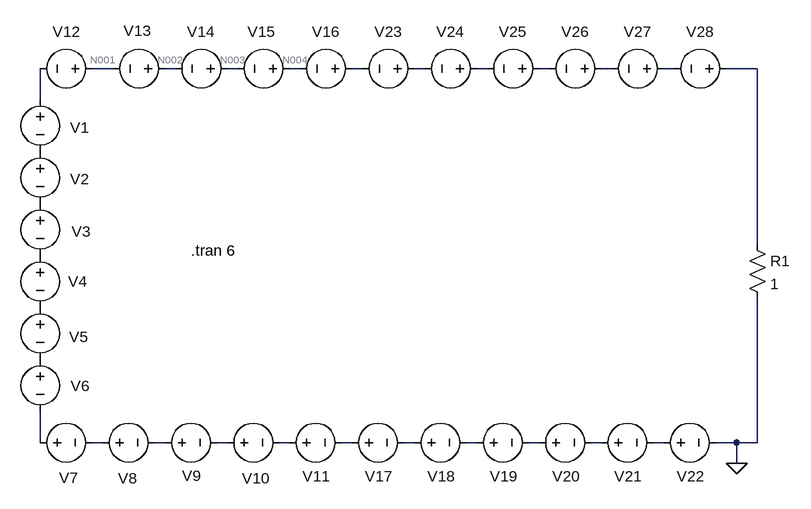
[diagram p0: schematic Cos.asc]
Cos.asc, the LTspice schematic file:
Version 4
SHEET 1 1740 680
WIRE -512 -16 -544 -16
WIRE -416 -16 -432 -16
WIRE -320 -16 -336 -16
WIRE -224 -16 -240 -16
WIRE -128 -16 -144 -16
WIRE -32 -16 -48 -16
WIRE 64 -16 48 -16
WIRE 160 -16 144 -16
WIRE 256 -16 240 -16
WIRE 352 -16 336 -16
WIRE 480 -16 432 -16
WIRE -624 32 -624 -16
WIRE 480 256 480 -16
WIRE -624 560 -624 512
WIRE -528 560 -544 560
WIRE -432 560 -448 560
WIRE -336 560 -352 560
WIRE -240 560 -256 560
WIRE -144 560 -160 560
WIRE -48 560 -64 560
WIRE 48 560 32 560
WIRE 144 560 128 560
WIRE 240 560 224 560
WIRE 336 560 320 560
WIRE 448 560 416 560
WIRE 480 560 480 336
WIRE 480 560 448 560
WIRE 448 592 448 560
FLAG 448 592 0
SYMBOL voltage -624 16 R0
WINDOW 123 0 0 Left 0
WINDOW 39 0 0 Left 0
WINDOW 0 46 59 Left 2
WINDOW 3 24 96 Invisible 2
SYMATTR InstName V1
SYMATTR Value SINE(0.31830989 0.21220659 1 0 0 90)
SYMBOL voltage -624 96 R0
WINDOW 123 0 0 Left 0
WINDOW 39 0 0 Left 0
WINDOW 0 46 58 Left 2
WINDOW 3 24 96 Invisible 2
SYMATTR InstName V2
SYMATTR Value SINE(0 -0.0424413 2 0 0 90)
SYMBOL voltage -624 176 R0
WINDOW 123 0 0 Left 0
WINDOW 39 0 0 Left 0
WINDOW 0 48 59 Left 2
WINDOW 3 24 96 Invisible 2
SYMATTR InstName V3
SYMATTR Value SINE(0 0.01818914 3 0 0 90)
SYMBOL res 464 240 R0
SYMATTR InstName R1
SYMATTR Value 1
SYMBOL voltage -624 256 R0
WINDOW 123 0 0 Left 0
WINDOW 39 0 0 Left 0
WINDOW 0 72 56 Right 2
WINDOW 3 -65 -119 Invisible 2
SYMATTR InstName V4
SYMATTR Value SINE(0 -0.0101051 4 0 0 90)
SYMBOL voltage -624 336 R0
WINDOW 123 0 0 Left 0
WINDOW 39 0 0 Left 0
WINDOW 0 74 61 Right 2
WINDOW 3 -65 -119 Invisible 2
SYMATTR InstName V5
SYMATTR Value SINE(0 0.0064305 5 0 0 90)
SYMBOL voltage -624 416 R0
WINDOW 123 0 0 Left 0
WINDOW 39 0 0 Left 0
WINDOW 0 76 57 Right 2
WINDOW 3 -65 -119 Invisible 2
SYMATTR InstName V6
SYMATTR Value SINE(0 -0.0044519 6 0 0 90)
SYMBOL voltage -640 560 R270
WINDOW 123 0 0 Left 0
WINDOW 39 0 0 Left 0
WINDOW 0 -54 45 VRight 2
WINDOW 3 -65 -119 Invisible 2
SYMATTR InstName V7
SYMATTR Value SINE(0 0.00326472 7 0 0 90)
SYMBOL voltage -544 560 R270
WINDOW 123 0 0 Left 0
WINDOW 39 0 0 Left 0
WINDOW 0 -55 40 VRight 2
WINDOW 3 -65 -119 Invisible 2
SYMATTR InstName V8
SYMATTR Value SINE(0 -0.0024965 8 0 0 90)
SYMBOL voltage -448 560 R270
WINDOW 123 0 0 Left 0
WINDOW 39 0 0 Left 0
WINDOW 0 -51 42 VRight 2
WINDOW 3 -65 -119 Invisible 2
SYMATTR InstName V9
SYMATTR Value SINE(0 0.42441318 1)
SYMBOL voltage -352 560 R270
WINDOW 123 0 0 Left 0
WINDOW 39 0 0 Left 0
WINDOW 0 -55 39 VRight 2
WINDOW 3 -65 -119 Invisible 2
SYMATTR InstName V10
SYMATTR Value SINE(0 0.16976527 2)
SYMBOL voltage -256 560 R270
WINDOW 123 0 0 Left 0
WINDOW 39 0 0 Left 0
WINDOW 0 -52 36 VRight 2
WINDOW 3 -65 -119 Invisible 2
SYMATTR InstName V11
SYMATTR Value SINE(0 0.10913482 3)
SYMBOL voltage -528 -16 R90
WINDOW 123 0 0 Left 0
WINDOW 39 0 0 Left 0
WINDOW 0 -57 34 VRight 2
WINDOW 3 -65 -119 Invisible 2
SYMATTR InstName V12
SYMATTR Value SINE(0 0.08084061 4)
SYMBOL voltage -416 -16 R90
WINDOW 123 0 0 Left 0
WINDOW 39 0 0 Left 0
WINDOW 0 -58 37 VRight 2
WINDOW 3 -65 -119 Invisible 2
SYMATTR InstName V13
SYMATTR Value SINE(0 0.06430503 5)
SYMBOL voltage -320 -16 R90
WINDOW 123 0 0 Left 0
WINDOW 39 0 0 Left 0
WINDOW 0 -57 35 VRight 2
WINDOW 3 -65 -119 Invisible 2
SYMATTR InstName V14
SYMATTR Value SINE(0 0.05342264 6)
SYMBOL voltage -224 -16 R90
WINDOW 123 0 0 Left 0
WINDOW 39 0 0 Left 0
WINDOW 0 -57 38 VRight 2
WINDOW 3 -65 -119 Invisible 2
SYMATTR InstName V15
SYMATTR Value SINE(0 0.04570603 7)
SYMBOL voltage -128 -16 R90
WINDOW 123 0 0 Left 0
WINDOW 39 0 0 Left 0
WINDOW 0 -57 35 VRight 2
WINDOW 3 -65 -119 Invisible 2
SYMATTR InstName V16
SYMATTR Value SINE(0 0.03994477 8)
SYMBOL voltage -160 560 R270
WINDOW 123 0 0 Left 0
WINDOW 39 0 0 Left 0
WINDOW 0 -52 36 VRight 2
WINDOW 3 -65 -119 Invisible 2
SYMATTR InstName V17
SYMATTR Value SINE(0 0.00197096 9 0 0 90)
SYMBOL voltage -64 560 R270
WINDOW 123 0 0 Left 0
WINDOW 39 0 0 Left 0
WINDOW 0 -52 36 VRight 2
WINDOW 3 -65 -119 Invisible 2
SYMATTR InstName V18
SYMATTR Value SINE(0 -0.0015955 10 0 0 90)
SYMBOL voltage 32 560 R270
WINDOW 123 0 0 Left 0
WINDOW 39 0 0 Left 0
WINDOW 0 -52 36 VRight 2
WINDOW 3 -65 -119 Invisible 2
SYMATTR InstName V19
SYMATTR Value SINE(0 0.00131805 11)
SYMBOL voltage 128 560 R270
WINDOW 123 0 0 Left 0
WINDOW 39 0 0 Left 0
WINDOW 0 -52 36 VRight 2
WINDOW 3 -65 -119 Invisible 2
SYMATTR InstName V20
SYMATTR Value SINE(0 -0.0011072 12)
SYMBOL voltage 224 560 R270
WINDOW 123 0 0 Left 0
WINDOW 39 0 0 Left 0
WINDOW 0 -52 36 VRight 2
WINDOW 3 -65 -119 Invisible 2
SYMATTR InstName V21
SYMATTR Value SINE(0 0.00094314 13)
SYMBOL voltage 320 560 R270
WINDOW 123 0 0 Left 0
WINDOW 39 0 0 Left 0
WINDOW 0 -52 36 VRight 2
WINDOW 3 -65 -119 Invisible 2
SYMATTR InstName V22
SYMATTR Value SINE(0 -0.0008131 14)
SYMBOL voltage -32 -16 R90
WINDOW 123 0 0 Left 0
WINDOW 39 0 0 Left 0
WINDOW 0 -57 35 VRight 2
WINDOW 3 -65 -119 Invisible 2
SYMATTR InstName V23
SYMATTR Value SINE(0 0.03547726 9)
SYMBOL voltage 64 -16 R90
WINDOW 123 0 0 Left 0
WINDOW 39 0 0 Left 0
WINDOW 0 -57 35 VRight 2
WINDOW 3 -65 -119 Invisible 2
SYMATTR InstName V24
SYMATTR Value SINE(0 0.03191077 10)
SYMBOL voltage 160 -16 R90
WINDOW 123 0 0 Left 0
WINDOW 39 0 0 Left 0
WINDOW 0 -57 35 VRight 2
WINDOW 3 -65 -119 Invisible 2
SYMATTR InstName V25
SYMATTR Value SINE(0 0.02899717 11)
SYMBOL voltage 256 -16 R90
WINDOW 123 0 0 Left 0
WINDOW 39 0 0 Left 0
WINDOW 0 -57 35 VRight 2
WINDOW 3 -65 -119 Invisible 2
SYMATTR InstName V26
SYMATTR Value SINE(0 0.02657196 12)
SYMBOL voltage 352 -16 R90
WINDOW 123 0 0 Left 0
WINDOW 39 0 0 Left 0
WINDOW 0 -57 35 VRight 2
WINDOW 3 -65 -119 Invisible 2
SYMATTR InstName V27
SYMATTR Value SINE(0 0.02452165 13)
SYMBOL voltage 448 -16 R90
WINDOW 123 0 0 Left 0
WINDOW 39 0 0 Left 0
WINDOW 0 -57 35 VRight 2
WINDOW 3 -65 -119 Invisible 2
SYMATTR InstName V28
SYMATTR Value SINE(0 0.02276546 14)
TEXT -392 264 Left 2 !.tran 6

The netlist it stands for:
* Cos.asc
V1 N012 P001 SINE(0.31830989 0.21220659 1 0 0 90)
V2 P001 P002 SINE(0 -0.0424413 2 0 0 90)
V3 P002 P003 SINE(0 0.01818914 3 0 0 90)
R1 N011 0 1
V4 P003 P004 SINE(0 -0.0101051 4 0 0 90)
V5 P004 P005 SINE(0 0.0064305 5 0 0 90)
V6 P005 N013 SINE(0 -0.0044519 6 0 0 90)
V7 N013 N014 SINE(0 0.00326472 7 0 0 90)
V8 N014 N015 SINE(0 -0.0024965 8 0 0 90)
V9 N015 N016 SINE(0 0.42441318 1)
V10 N016 N017 SINE(0 0.16976527 2)
V11 N017 N018 SINE(0 0.10913482 3)
V12 N001 N012 SINE(0 0.08084061 4)
V13 N002 N001 SINE(0 0.06430503 5)
V14 N003 N002 SINE(0 0.05342264 6)
V15 N004 N003 SINE(0 0.04570603 7)
V16 N005 N004 SINE(0 0.03994477 8)
V17 N018 N019 SINE(0 0.00197096 9 0 0 90)
V18 N019 N020 SINE(0 -0.0015955 10 0 0 90)
V19 N020 N021 SINE(0 0.00131805 11)
V20 N021 N022 SINE(0 -0.0011072 12)
V21 N022 N023 SINE(0 0.00094314 13)
V22 N023 0 SINE(0 -0.0008131 14)
V23 N006 N005 SINE(0 0.03547726 9)
V24 N007 N006 SINE(0 0.03191077 10)
V25 N008 N007 SINE(0 0.02899717 11)
V26 N009 N008 SINE(0 0.02657196 12)
V27 N010 N009 SINE(0 0.02452165 13)
V28 N011 N010 SINE(0 0.02276546 14)
.tran 6
.backanno
.end

* Results of the author's LTspice run, read from the files saved beside the schematic
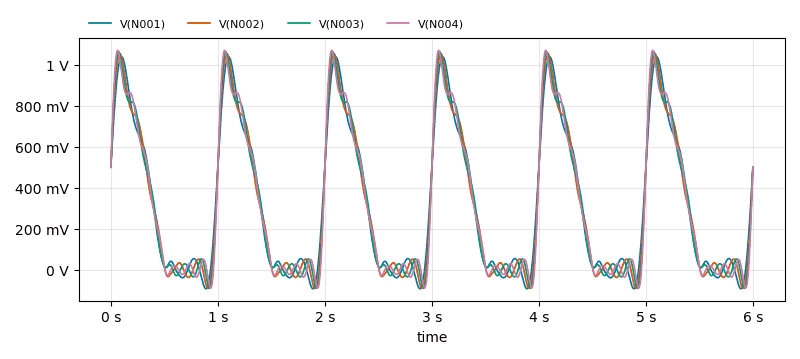
[diagram p1: Transient Analysis of Cos.asc, plotted from the saved traces]
* Transient Analysis, 1 run:
*   V(N001): min -93.57 mV, max 1.037 V, average 318.3 mV, rms 488.6 mV, last 499.3 mV
*   V(N002): min -91.56 mV, max 1.052 V, average 318.3 mV, rms 490.7 mV, last 499.3 mV
*   V(N003): min -90.15 mV, max 1.062 V, average 318.3 mV, rms 492.1 mV, last 499.3 mV
*   V(N004): min -89.62 mV, max 1.069 V, average 318.3 mV, rms 493.2 mV, last 499.3 mV